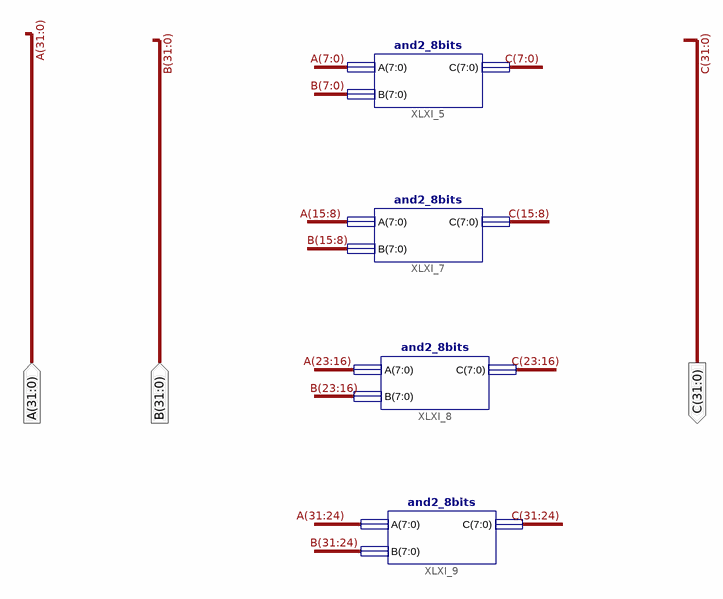
[diagram p0: schematic sheet 1]
// Xilinx ISE schematic and2_32.sch (artix7) as structural Verilog: 4 symbols, 3 ports
module and2_32 (
  input  [31:0] A,
  input  [31:0] B,
  output [31:0] C
);

  and2_8bits XLXI_5 (.A(A[7:0]), .B(B[7:0]), .C(C[7:0]));
  and2_8bits XLXI_7 (.A(A[15:8]), .B(B[15:8]), .C(C[15:8]));
  and2_8bits XLXI_8 (.A(A[23:16]), .B(B[23:16]), .C(C[23:16]));
  and2_8bits XLXI_9 (.A(A[31:24]), .B(B[31:24]), .C(C[31:24]));
endmodule
